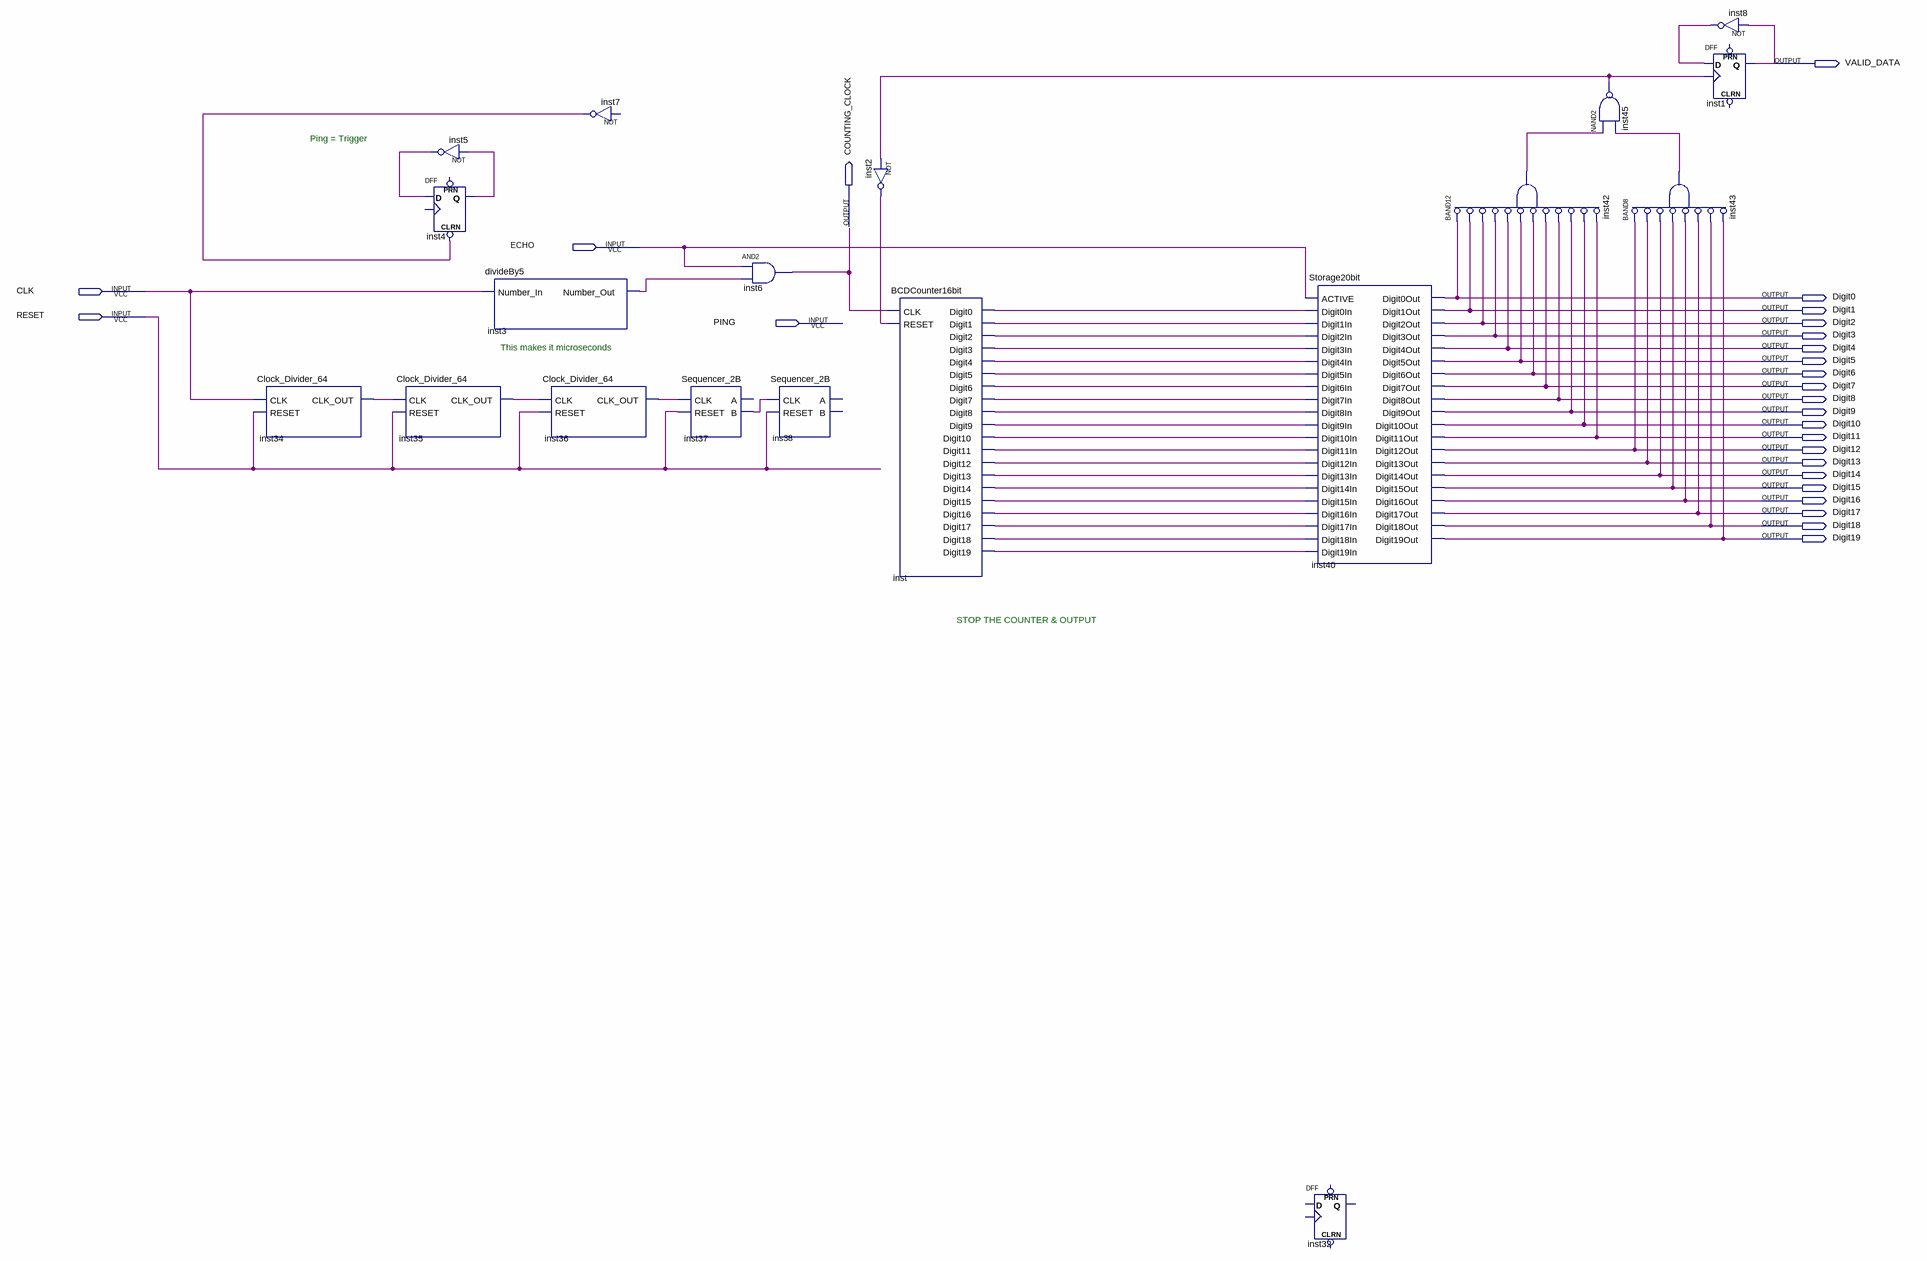
[diagram p0: schematic sheet]
// Quartus schematic measure_ultrasonic_sensor_time_interval.bdf as structural Verilog: 19 symbols, 26 pins
module measure_ultrasonic_sensor_time_interval (
  input  ECHO,
  input  CLK,
  input  RESET,
  input  PING,
  output VALID_DATA,
  output COUNTING_CLOCK,
  output Digit0,
  output Digit1,
  output Digit2,
  output Digit3,
  output Digit4,
  output Digit5,
  output Digit6,
  output Digit7,
  output Digit8,
  output Digit9,
  output Digit10,
  output Digit11,
  output Digit12,
  output Digit13,
  output Digit14,
  output Digit15,
  output Digit16,
  output Digit17,
  output Digit18,
  output Digit19
);

  wire inst2_out, inst3_number_out, inst4_q, inst5_out, inst7_out, inst8_out, inst34_clk_out, inst35_clk_out,
       inst36_clk_out, inst37_b, inst42_out, inst43_out, inst45_out, inst_digit0, inst_digit1, inst_digit2,
       inst_digit3, inst_digit4, inst_digit5, inst_digit6, inst_digit7, inst_digit8, inst_digit9,
       inst_digit10, inst_digit11, inst_digit12, inst_digit13, inst_digit14, inst_digit15, inst_digit16,
       inst_digit17, inst_digit18, inst_digit19;

  Clock_Divider_64 inst34 (.CLK(CLK), .RESET(RESET), .CLK_OUT(inst34_clk_out));
  Clock_Divider_64 inst35 (.CLK(inst34_clk_out), .RESET(RESET), .CLK_OUT(inst35_clk_out));
  not inst5 (inst5_out, inst4_q);
  DFF inst4 (.CLRN(inst7_out), .D(inst5_out), .Q(inst4_q));  // open: CLK, PRN
  divideBy5 inst3 (.Number_In(CLK), .Number_Out(inst3_number_out));
  Clock_Divider_64 inst36 (.CLK(inst35_clk_out), .RESET(RESET), .CLK_OUT(inst36_clk_out));
  // NOT inst7 has open pins: IN=open, OUT=inst7_out
  Sequencer_2B inst37 (.CLK(inst36_clk_out), .RESET(RESET), .B(inst37_b));  // open: A
  and inst6 (COUNTING_CLOCK, ECHO, inst3_number_out);
  Sequencer_2B ins38 (.CLK(inst37_b), .RESET(RESET));  // open: A, B
  not inst2 (inst2_out, inst45_out);
  BCDCounter16bit inst (
    .CLK(COUNTING_CLOCK), .RESET(inst2_out), .Digit0(inst_digit0), .Digit1(inst_digit1),
    .Digit2(inst_digit2), .Digit3(inst_digit3), .Digit4(inst_digit4), .Digit5(inst_digit5),
    .Digit6(inst_digit6), .Digit7(inst_digit7), .Digit8(inst_digit8), .Digit9(inst_digit9),
    .Digit10(inst_digit10), .Digit11(inst_digit11), .Digit12(inst_digit12), .Digit13(inst_digit13),
    .Digit14(inst_digit14), .Digit15(inst_digit15), .Digit16(inst_digit16), .Digit17(inst_digit17),
    .Digit18(inst_digit18), .Digit19(inst_digit19));
  Storage20bit inst40 (
    .ACTIVE(ECHO), .Digit0In(inst_digit0), .Digit1In(inst_digit1), .Digit2In(inst_digit2),
    .Digit3In(inst_digit3), .Digit4In(inst_digit4), .Digit5In(inst_digit5), .Digit6In(inst_digit6),
    .Digit7In(inst_digit7), .Digit8In(inst_digit8), .Digit9In(inst_digit9), .Digit10In(inst_digit10),
    .Digit11In(inst_digit11), .Digit12In(inst_digit12), .Digit13In(inst_digit13), .Digit14In(inst_digit14),
    .Digit15In(inst_digit15), .Digit16In(inst_digit16), .Digit17In(inst_digit17), .Digit18In(inst_digit18),
    .Digit19In(inst_digit19), .Digit0Out(Digit0), .Digit1Out(Digit1), .Digit2Out(Digit2), .Digit3Out(Digit3),
    .Digit4Out(Digit4), .Digit5Out(Digit5), .Digit6Out(Digit6), .Digit7Out(Digit7), .Digit8Out(Digit8),
    .Digit9Out(Digit9), .Digit10Out(Digit10), .Digit11Out(Digit11), .Digit12Out(Digit12),
    .Digit13Out(Digit13), .Digit14Out(Digit14), .Digit15Out(Digit15), .Digit16Out(Digit16),
    .Digit17Out(Digit17), .Digit18Out(Digit18), .Digit19Out(Digit19));
  DFF inst32 ();  // open: CLRN, CLK, D, PRN, Q
  and inst42 (inst42_out, ~Digit0, ~Digit1, ~Digit2, ~Digit3, ~Digit4, ~Digit5, ~Digit6, ~Digit7, ~Digit8, ~Digit9, ~Digit10, ~Digit11);  // BAND12
  nand inst45 (inst45_out, inst42_out, inst43_out);
  and inst43 (inst43_out, ~Digit12, ~Digit13, ~Digit14, ~Digit15, ~Digit16, ~Digit17, ~Digit18, ~Digit19);  // BAND8
  not inst8 (inst8_out, VALID_DATA);
  DFF inst1 (.CLK(inst45_out), .D(inst8_out), .Q(VALID_DATA));  // open: CLRN, PRN

  // Notes on the sheet:
  //   Ping = Trigger
  //   This makes it microseconds
  //   STOP THE COUNTER & OUTPUT
endmodule
